# EAGLE design FlatFlexPSensorLongerACF (EAGLE 7.6.0)
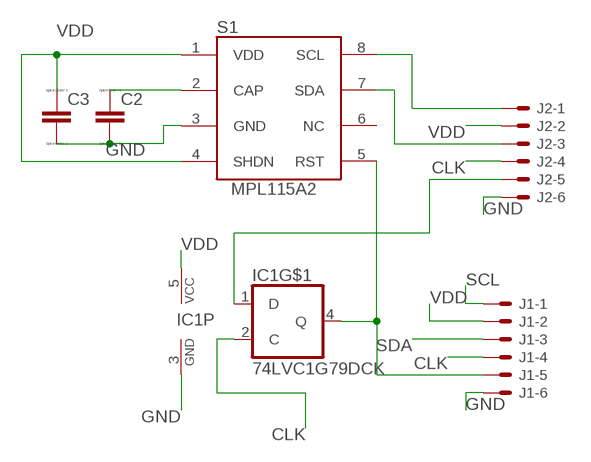
[diagram p0: schematic, sheet 1]

## Parts
C2  CC0402  [C0402]
C3  CC0402  [C0402]
IC1  74LVC1G79DCK  [SC70-5]
J1  XF2L-0625-1  [XF2L-0625-1]
J2  XF2L-0625-1  [XF2L-0625-1]
S1  MPL115A2  [LGA8]

## Nets
CLK: IC1.2(C) J1.4 J2.4
D: IC1.1(D) J2.5
GND: C2.2 C3.2 IC1.3(GND) J1.6 J2.6 S1.3(GND)
N$1: C2.1 S1.2(CAP)
Q: IC1.4(Q) J1.5 S1.5(RST)
SCL: J1.1 J2.1 S1.8(SCL)
SDA: J1.3 J2.3 S1.7(SDA)
VDD: C3.1 IC1.5(VCC) J1.2 J2.2 S1.1(VDD) S1.4(SHDN)
Unconnected: S1.6(NC)

## Library data of the parts
C2 C3 = eagle-ltspice:C: CAPACITOR, European symbol; SPICEMODEL: NONE; SPICEPREFIX: C
IC1 = 74xx-little-de:74*1G79: Single Positive-Edge-Triggered D-Type Flip-Flop Source: Data sheet <http://www.ti.com/lit/ds/symlink/sn74lvc1g79.pdf>
J1 J2 = MOD_OMRON:XF2*-06?: OMRON FPC Connector Source : http://www.omron.com/ecb/products/pdf/fpc.pdf; MF: OMRON COMPONENTS USA; MPN: XF2L-0625-1; OC_FARNELL: 1536105; OC_NEWARK: 29C7842
S1 = Youritronics:MPL115A2: MPL115A2 employs a MEMS pressure sensor with a conditioning IC to provide accurate pressure measurement from 50 to 115 kPa. An integrated ADC provides digitized temperature and pressure sensor outputs via an I2C port. Calibration Data is stored in internal ROM. Utilizing raw sensor output, the host microcontroller executes a compensation algorithm to render Compensated Absolute Pressure with 1 kPa accuracy. Features: Digitized pressure and temperature information together with programmed calibration coefficients for host micro use. Factory Calibrated 50 kPa to 115 kPa Absolute Pressure 1 kPa Accuracy 2.375 V to 5.5 V Supply Integrated ADC I2C Interface

## Net classes
0 default: width 0.127 mm, drill 0.508 mm, clearance 0.254 mm

## Board
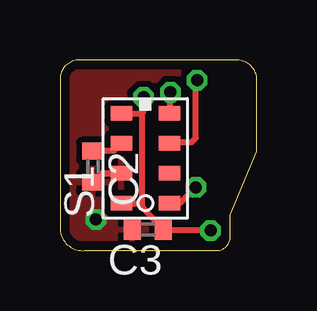
[diagram p1: board, top side]
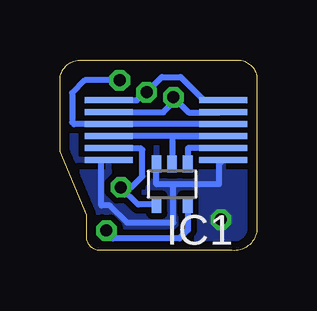
[diagram p2: board, bottom side, seen from below]

Size 8.2 x 7.96 mm. Coordinates in mm from the lower left corner, seen from the top.
Outline: 0,0.87 arc90 1.04,0 6.6,0 arc90 7.09,0.69 7.09,1.5 8.2,4.14 8.2,7.21 arc90 7.23,7.95 0.8,7.95 arc90 0,7.16 0,0.87
Copper layers (1*16): Top 0.0356mm / dielectric 1.5011mm / Bottom 0.0356mm
Design rules "LaenPCBOrder": minimum track width 6mil, minimum drill 13mil, track to track 6mil, track to pad 6mil, pad to pad 6mil, via to via 6mil, smd to smd 6mil, copper to edge 15mil, drill to drill 6mil, minimum pad ring 7mil, minimum via ring 7mil, stop-mask expansion 3mil, vias tented up to drill 0mil, thermal gap 10mil

### Footprints (pad centres in the part's own frame; a part is rotated, then mirrored left to right if it is on the bottom)
C0402 = smd 0.7 x 0.9: 1 -0.65,0; 2 0.65,0
SC70-5 = smd 0.4 x 0.7: 1 -0.65,-0.85; 2 0,-0.85; 3 0.65,-0.85; 4 0.65,0.85; 5 -0.65,0.85
XF2L-0625-1 = smd 2 x 0.25: 1 2.405,1.25; 2 2.405,0.75; 3 2.405,0.25; 4 2.405,-0.25; 5 2.405,-0.75; 6 2.405,-1.25
LGA8 = smd 0.9 x 0.6: 1 -2.5,2.5; 2 -2.5,1.25; 3 -2.5,0; 4 -2.5,-1.25; 5 -0.5,-1.25; 6 -0.5,0; 7 -0.5,1.25; 8 -0.5,2.5

### Placement (x,y rotation side)
C2  1.37,3.51 270 top
C3  3.66,0.89 180 top
IC1  3.53,2.77 180 bottom
J1  8.59,5.03 0 bottom
J2  3.81,5.03 0 bottom
S1  5.05,3.23 0 top

### Tracks (layer width: path | path; a pad name or v marks a point on that pad's centre or on a via)
CLK
  Bottom 0.254: IC1.2 3.53,4.78 1.58,4.78 | 1.58,4.78 J2.4 | 1.58,4.78 J1.4
D
  Bottom 0.254: J2.5 2.88,4.28 IC1.1
GND  (via drill 0.5)
  Top 0.254: 1.22,2.67 1.78,3.23 S1.3 1.74,3.23 C2.2 1.27,2.76 | 2.86,0.74 arc90 C3.2
  Bottom 0.254: IC1.3 4.19,3.62 4.19,2.77 3.48,2.77 | J1.6 6.41,3.78 6.48,3.74 6.48,1.88 6.12,1.88 5.41,1.17 3.48,1.17 3.48,2.77 | 3.48,2.77 1.58,2.77 1.58,3.61 J2.6
  other vias: 1.5,1.3
  pour Bottom: 0,0 7.09,0 7.09,1.43 8.2,4.14 8.2,7.93 0,7.93
  pour Top: 0,0 7.09,0 7.09,1.43 8.2,4.14 8.2,7.93 0,7.93
N$1
  Top 0.254: S1.2 2.23,4.16 C2.1
Q  (via drill 0.5)
  Top 0.254: S1.5 5,1.98 v5.66,2.65
  Bottom 0.254: J1.5 4.85,4.28 4.78,4.21 4.78,3.1 5.23,2.65 v5.66,2.65 4.94,1.92 IC1.4
SCL  (via drill 0.5)
  Top 0.254: S1.8 4.6,5.73 v4.6,6.61
  Bottom 0.254: J1.1 5,6.28 4.67,6.61 v4.6,6.61 3.96,7.24 3.18,7.24 2.22,6.28 J2.1
SDA  (via drill 0.5)
  Top 0.254: S1.7 4.6,4.53 5.49,4.53 5.66,4.7 5.66,7.07 v5.72,7.12
  Bottom 0.254: J2.3 J1.3 7.62,5.28 7.7,5.36 7.7,6.58 7.16,7.12 v5.72,7.12
VDD  (via drill 0.5)
  Top 0.254: S1.1 3.4,5.73 | 3.4,5.73 3.4,1.96 | 3.4,1.96 2.55,1.96 S1.4 3.21,1.98 | C3.1 4.31,0.93 | 3.4,1.96 3.43,1.82 C3.1 | 4.41,0.79 C3.1 | v6.27,0.84 4.36,0.84 C3.1 | 3.4,5.73 3.48,5.81 v3.48,6.41
  Bottom 0.254: J1.2 3.9,5.78 3.48,6.2 v3.48,6.41 2.85,5.77 1.59,5.77 J2.2 | IC1.5 2.88,0.86 3.23,0.51 5.99,0.51 5.99,0.56 v6.27,0.84